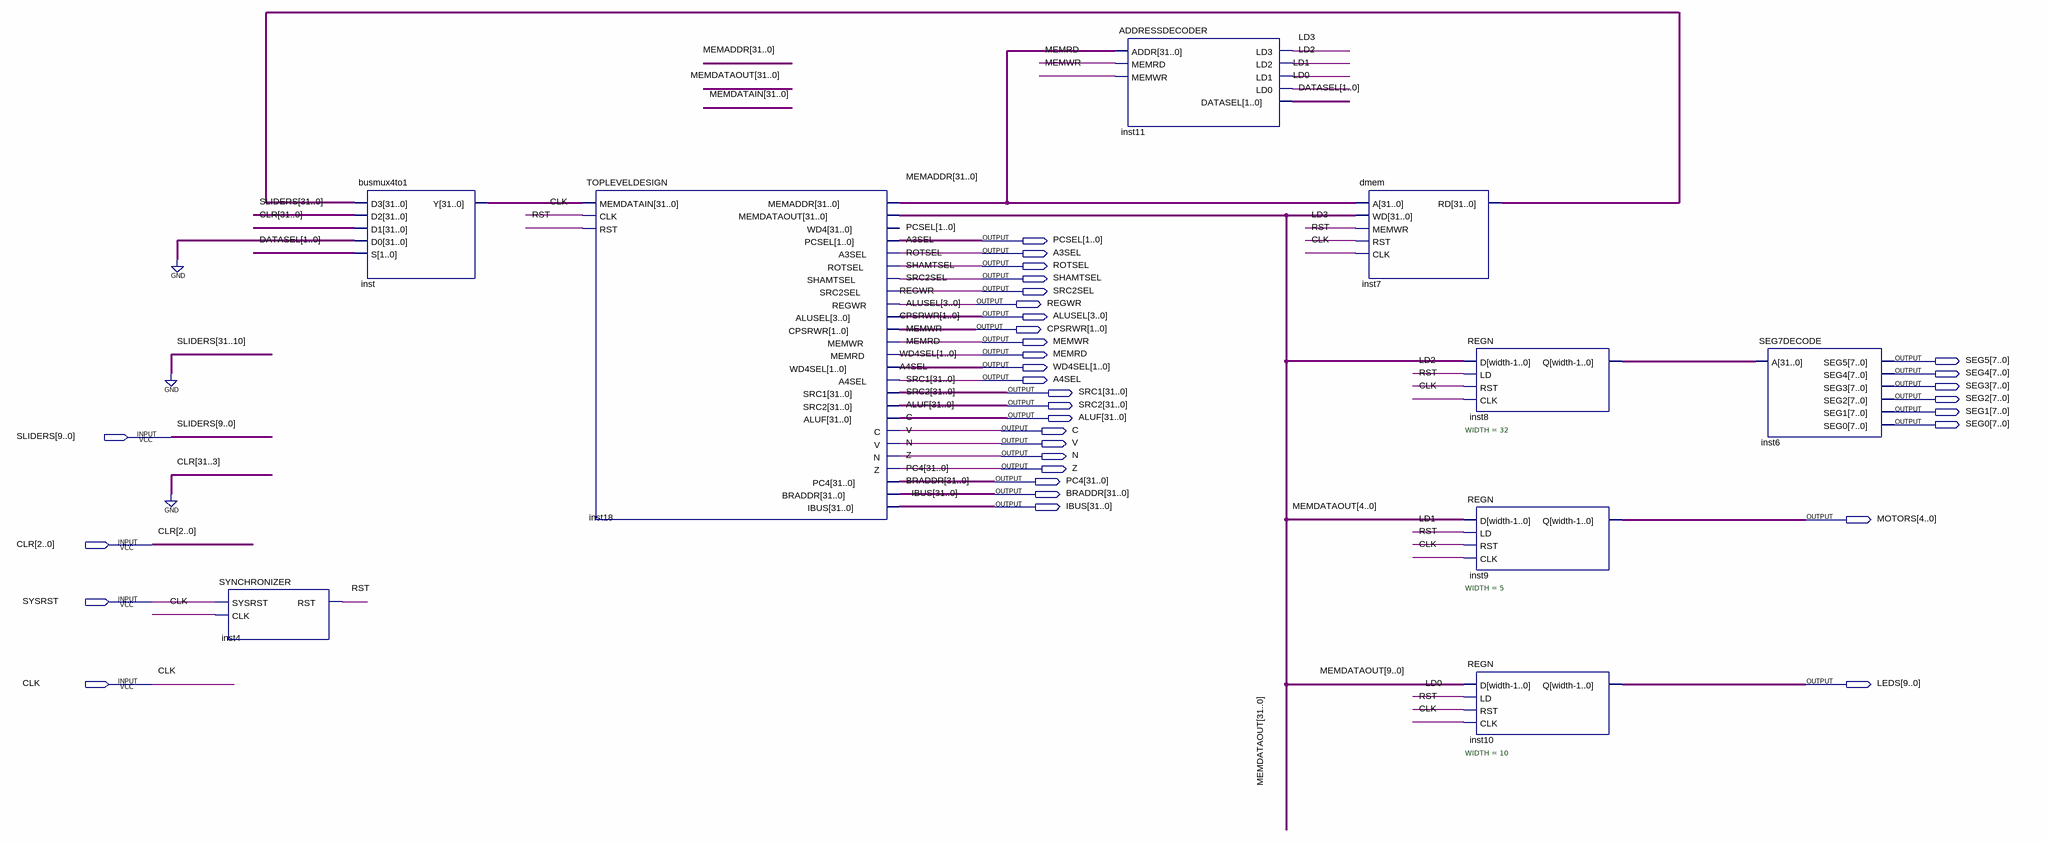
[diagram p0: schematic sheet]
// Quartus schematic SYSTEM.bdf as structural Verilog: 9 symbols, 34 pins
module SYSTEM (
  input  [9:0] SLIDERS,
  input  [2:0] CLR,
  input  SYSRST,
  input  CLK,
  output [1:0] PCSEL,
  output A3SEL,
  output ROTSEL,
  output SHAMTSEL,
  output SRC2SEL,
  output REGWR,
  output [3:0] ALUSEL,
  output [1:0] CPSRWR,
  output MEMWR,
  output MEMRD,
  output [7:0] SEG5,
  output [1:0] WD4SEL,
  output [7:0] SEG4,
  output A4SEL,
  output [7:0] SEG3,
  output [31:0] SRC1,
  output [7:0] SEG2,
  output [31:0] SRC2,
  output [7:0] SEG1,
  output [31:0] ALUF,
  output [7:0] SEG0,
  output C,
  output V,
  output N,
  output Z,
  output [31:0] PC4,
  output [31:0] BRADDR,
  output [31:0] IBUS,
  output [4:0] MOTORS,
  output [9:0] LEDS
);

  wire LD0, LD1, LD2, LD3, RST;
  wire [1:0] DATASEL;
  wire [31:0] inst7_rd, inst8_q, inst_y, MEMADDR, MEMDATAOUT;

  SYNCHRONIZER inst4 (.SYSRST(SYSRST), .CLK(CLK), .RST(RST));
  busmux4to1 inst (
    .D3(inst7_rd), .D2({{22{1'b0}}, SLIDERS}), .D1({{29{1'b0}}, CLR}), .D0({32{1'b0}}), .S(DATASEL),
    .Y(inst_y));
  TOPLEVELDESIGN inst18 (
    .MEMDATAIN(inst_y), .CLK(CLK), .RST(RST), .MEMADDR(MEMADDR), .MEMDATAOUT(MEMDATAOUT), .PCSEL(PCSEL),
    .A3SEL(A3SEL), .ROTSEL(ROTSEL), .SHAMTSEL(SHAMTSEL), .SRC2SEL(SRC2SEL), .REGWR(REGWR), .ALUSEL(ALUSEL),
    .CPSRWR(CPSRWR), .MEMWR(MEMWR), .MEMRD(MEMRD), .WD4SEL(WD4SEL), .A4SEL(A4SEL), .SRC1(SRC1), .SRC2(SRC2),
    .ALUF(ALUF), .C(C), .V(V), .N(N), .Z(Z), .PC4(PC4), .BRADDR(BRADDR), .IBUS(IBUS));  // open: WD4
  ADDRESSDECODER inst11 (
    .ADDR(MEMADDR), .MEMRD(MEMRD), .MEMWR(MEMWR), .LD3(LD3), .LD2(LD2), .LD1(LD1), .LD0(LD0),
    .DATASEL(DATASEL));
  dmem inst7 (.A(MEMADDR), .WD(MEMDATAOUT), .MEMWR(LD3), .RST(RST), .CLK(CLK), .RD(inst7_rd));
  REGN #(.WIDTH(32)) inst8 (.D(MEMDATAOUT), .LD(LD2), .RST(RST), .CLK(CLK), .Q(inst8_q));
  REGN #(.WIDTH(5)) inst9 (.D(MEMDATAOUT[4:0]), .LD(LD1), .RST(RST), .CLK(CLK), .Q(MOTORS));
  REGN #(.WIDTH(10)) inst10 (.D(MEMDATAOUT[9:0]), .LD(LD0), .RST(RST), .CLK(CLK), .Q(LEDS));
  SEG7DECODE inst6 (.A(inst8_q), .SEG5(SEG5), .SEG4(SEG4), .SEG3(SEG3), .SEG2(SEG2), .SEG1(SEG1), .SEG0(SEG0));
endmodule
